# Altium schematic sheet LED.SchDoc
size A; Organization: Cal Poly Racing; engineer1: who?
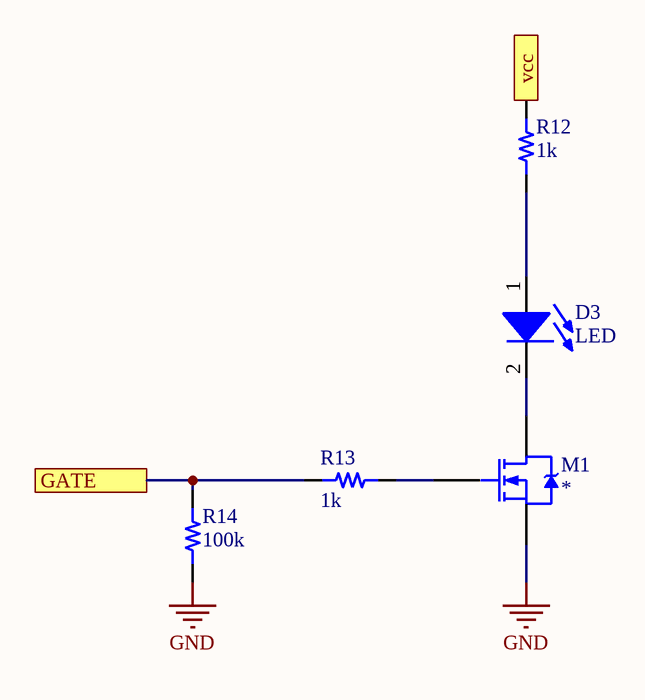
[diagram p0: LED.SchDoc]

## Parts
D3  LED  [0805_LED]
M1  *  [SOT23-3]
R12  resistance: 1k  [RES 0603/1608]
R13  resistance: 1k  [RES 0603/1608]
R14  resistance: 100k  [RES 0603/1608]

## Ports
GATE, vcc

## Nets
GND: M1.2(S) R14.1
GATE: R13.2 R14.2 ; port GATE
vcc: R12.2 ; port vcc
NetD3_1: D3.1(A) R12.1
NetD3_2: D3.2(K) M1.3(D)
NetM1_1: M1.1(G) R13.1

## Notes on the sheet
- Date:
- Time:
- File:

## Library data of the parts
D3 = 19: Generic 0805 LED; id: 19; vr: 1; name: 0805 LED; numcircuits: 1; package: 0805; quantity: 0
M1 = 6: MOSFET N-CHANNEL 30V 5A SOT23; id: 6; vdsmax: 0; numcircuits: 1; current: 2.8A; rdson: 90mOhm; vt: 800; MfrPartNo: *; name: DMG2302UK-7; type: N_Channel; vgsmax: 1; package: SOT-23; quantity: 0; link: https://www.digikey.com/product-detail/en/diodes-incorporated/DMG2302UK-7/DMG2302UK-7DICT-ND/6010163
R12-R14 = 1: id: 1; name: 0603 Resistor; percent tolerance: 5; package: 0603; quantity: 0